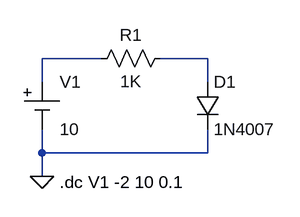
[diagram p0: schematic simulacionDiodo1N4007.asc]
simulacionDiodo1N4007.asc, the LTspice schematic file:
Version 4.1
SHEET 1 880 680
WIRE 128 96 48 96
WIRE 272 96 208 96
WIRE 48 128 48 96
WIRE 272 128 272 96
WIRE 48 224 48 192
WIRE 272 224 272 192
WIRE 272 224 48 224
WIRE 48 256 48 224
FLAG 48 256 0
SYMBOL diode 256 128 R0
SYMATTR InstName D1
SYMATTR Value 1N4007
SYMBOL res 224 80 R90
WINDOW 0 0 56 VBottom 2
WINDOW 3 32 56 VTop 2
SYMATTR InstName R1
SYMATTR Value 1K
SYMBOL Misc\\cell 48 128 R0
WINDOW 123 0 0 Left 0
WINDOW 39 0 0 Left 0
SYMATTR InstName V1
SYMATTR Value 10
TEXT 72 264 Left 2 !.dc V1 -2 10 0.1

The netlist it stands for:
* simulacionDiodo1N4007.asc
D1 N002 0 1N4007
R1 N002 N001 1K
V1 N001 0 10
.model D D
.lib standard.dio
.dc V1 -2 10 0.1
.backanno
.end